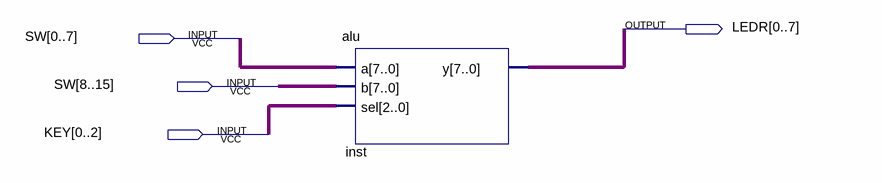
[diagram p0: schematic sheet]
// Quartus schematic HW3_ALU.bdf as structural Verilog: 1 symbols, 4 pins
module HW3_ALU (
  input  [0:15] SW,
  input  [0:2] KEY,
  output [0:7] LEDR
);

  alu inst (.a(SW[0:7]), .b(SW[8:15]), .sel(KEY), .y(LEDR));
endmodule
